# Altium schematic sheet lpGBTs.SchDoc: LpGBT
size A; DocumentNumber: 6; SheetNumber: 6; SheetTotal: 22
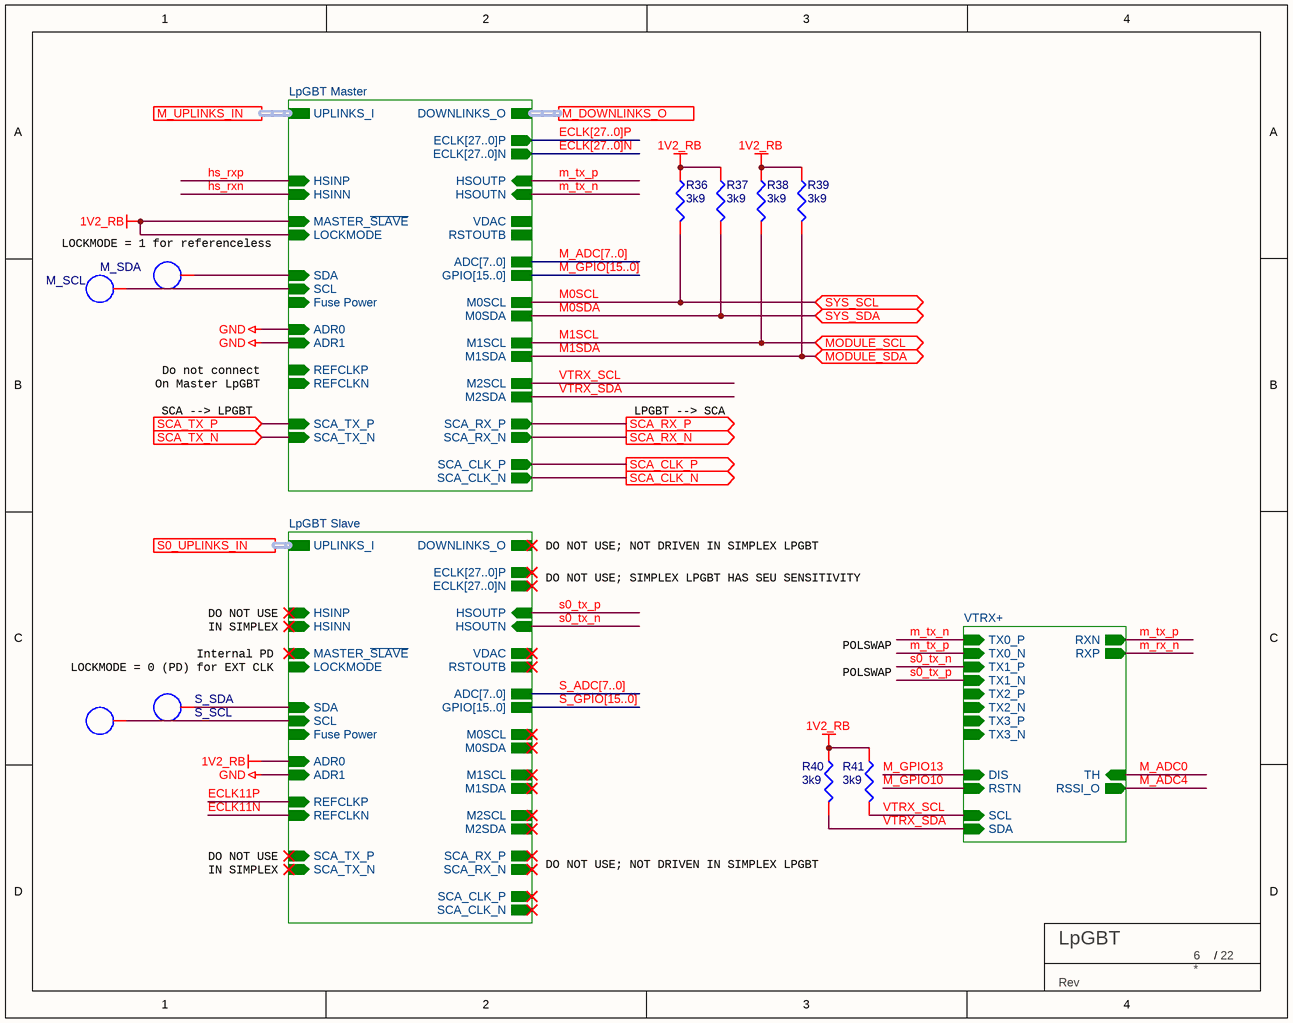
[diagram p0: lpGBTs.SchDoc]

## Parts
R36  3k9  [R_0402_IPC]
R37  3k9  [R_0402_IPC]
R38  3k9  [R_0402_IPC]
R39  3k9  [R_0402_IPC]
R40  3k9  [R_0402_IPC]
R41  3k9  [R_0402_IPC]
TBLOCK?  BU Title block  (value not drawn)  (graphical)
TP7  M_SDA  [testpoint]  (no BOM)
TP8  M_SCL  [testpoint]  (no BOM)
TP9  S_SDA  [testpoint]  (no BOM)
TP10  S_SCL  [testpoint]  (no BOM)

## Sub-sheets
LpGBT Master = lpgbt-Config.SchDoc;lpgbt-Power.SchDoc;lpgbt-Elinks.SchDoc;lpgbt-SC-HSIO.SchDoc;lpgbt-Clocks.SchDoc: DOWNLINKS_O (harness DOWNLINK), VDAC, SCA_CLK_N (out), RSTOUTB, REFCLKP (in), HSOUTN (in), SCA_TX_N (in), SCA_RX_P (out), SCL (in), ADC[7..0], MASTER_~{SLAVE} (in), SCA_RX_N (out), SCA_TX_P (in), M2SDA, HSINN (in), HSOUTP (in), Fuse Power (in), REFCLKN (in), HSINP (in), M2SCL, GPIO[15..0], ADR0 (in), UPLINKS_I (harness UPLINK), ADR1 (in), SDA (in), SCA_CLK_P (out), ECLK[27..0]N (out), ECLK[27..0]P (out), M0SDA, M0SCL, M1SCL, M1SDA, LOCKMODE (in)
LpGBT Slave = lpgbt-Config.SchDoc;lpgbt-Power.SchDoc;lpgbt-Elinks.SchDoc;lpgbt-SC-HSIO.SchDoc;lpgbt-Clocks.SchDoc: DOWNLINKS_O (harness DOWNLINK), VDAC, SCA_CLK_N (out), RSTOUTB, REFCLKP (in), HSOUTN (in), SCA_TX_N (in), SCA_RX_P (out), SCL (in), ADC[7..0], MASTER_~{SLAVE} (in), M0SDA, M0SCL, SCA_RX_N (out), M1SCL, SCA_TX_P (in), M2SDA, HSINN (in), HSOUTP (in), M1SDA, Fuse Power (in), REFCLKN (in), HSINP (in), M2SCL, GPIO[15..0], ADR0 (in), UPLINKS_I (harness UPLINK), ADR1 (in), SDA (in), SCA_CLK_P (out), ECLK[27..0]N (out), ECLK[27..0]P (out), LOCKMODE (in)
VTRX+ = VTRX.SchDoc: TX0_N (in), TX1_P (in), TX1_N (in), TX2_P (in), TX2_N (in), TX3_P (in), TX0_P (in), RXN (out), TX3_N (in), DIS (in), RXP (out), RSTN (in), TH (in), RSSI_O (out), SCL (in), SDA (in)

## Ports
M_DOWNLINKS_O (harness UPLINK), M_UPLINKS_IN (harness UPLINK), MODULE_SCL (bidir), MODULE_SDA (bidir), S0_UPLINKS_IN (harness UPLINK), SCA_CLK_N (out), SCA_CLK_P (out), SCA_RX_N (out), SCA_RX_P (out), SCA_TX_N (in), SCA_TX_P (in), SYS_SCL (bidir), SYS_SDA (bidir)

## Nets
1V2_RB: R36.1 R37.1 R38.1 R39.1 R40.1 R41.1 ; sheet LpGBT Master/MASTER_~{SLAVE}, sheet LpGBT Master/LOCKMODE, sheet LpGBT Slave/ADR0
GND: sheet LpGBT Master/ADR0, sheet LpGBT Master/ADR1, sheet LpGBT Slave/ADR1
ECLK11N: sheet LpGBT Slave/REFCLKN
ECLK11P: sheet LpGBT Slave/REFCLKP
hs_rxn: sheet LpGBT Master/HSINN
hs_rxp: sheet LpGBT Master/HSINP
M0SCL: R36.2 ; port SYS_SCL, sheet LpGBT Master/M0SCL
M0SDA: R37.2 ; port SYS_SDA, sheet LpGBT Master/M0SDA
M1SCL: R38.2 ; port MODULE_SCL, sheet LpGBT Master/M1SCL
M1SDA: R39.2 ; port MODULE_SDA, sheet LpGBT Master/M1SDA
M_ADC0: sheet VTRX+/TH
M_ADC4: sheet VTRX+/RSSI_O
M_GPIO10: sheet VTRX+/RSTN
M_GPIO13: sheet VTRX+/DIS
m_rx_n: sheet VTRX+/RXP
m_tx_n: sheet LpGBT Master/HSOUTN, sheet VTRX+/TX0_P
m_tx_p: sheet LpGBT Master/HSOUTP, sheet VTRX+/TX0_N, sheet VTRX+/RXN
s0_tx_n: sheet LpGBT Slave/HSOUTN, sheet VTRX+/TX1_P
s0_tx_p: sheet LpGBT Slave/HSOUTP, sheet VTRX+/TX1_N
SCA_CLK_N: port SCA_CLK_N, sheet LpGBT Master/SCA_CLK_N
SCA_CLK_P: port SCA_CLK_P, sheet LpGBT Master/SCA_CLK_P
SCA_RX_N: port SCA_RX_N, sheet LpGBT Master/SCA_RX_N
SCA_RX_P: port SCA_RX_P, sheet LpGBT Master/SCA_RX_P
SCA_TX_N: port SCA_TX_N, sheet LpGBT Master/SCA_TX_N
SCA_TX_P: port SCA_TX_P, sheet LpGBT Master/SCA_TX_P
VTRX_SCL: R41.2 ; sheet LpGBT Master/M2SCL, sheet VTRX+/SCL
VTRX_SDA: R40.2 ; sheet LpGBT Master/M2SDA, sheet VTRX+/SDA
NetTP7_1: TP7.1(TP) ; sheet LpGBT Master/SDA
NetTP8_1: TP8.1(TP) ; sheet LpGBT Master/SCL
NetTP9_1: TP9.1(TP) ; sheet LpGBT Slave/SDA
NetTP10_1: TP10.1(TP) ; sheet LpGBT Slave/SCL

## Buses and harness runs
bus ECLK[27..0]N = sheet LpGBT Master/ECLK[27..0]N
bus ECLK[27..0]P = sheet LpGBT Master/ECLK[27..0]P
bus M_ADC[7..0] = sheet LpGBT Master/ADC[7..0]
bus M_GPIO[15..0] = sheet LpGBT Master/GPIO[15..0]
bus S_ADC[7..0] = sheet LpGBT Slave/ADC[7..0]
bus S_GPIO[15..0] = sheet LpGBT Slave/GPIO[15..0]
harness port M_DOWNLINKS_O = sheet LpGBT Master/DOWNLINKS_O
harness port M_UPLINKS_IN = sheet LpGBT Master/UPLINKS_I
harness port S0_UPLINKS_IN = sheet LpGBT Slave/UPLINKS_I

## Notes on the sheet
- LOCKMODE = 1 for referenceless
- Do not connect
- SCA --> LPGBT
- On Master LpGBT
- LPGBT --> SCA
- DO NOT USE; NOT DRIVEN IN SIMPLEX LPGBT
- DO NOT USE
- IN SIMPLEX
- DO NOT USE; SIMPLEX LPGBT HAS SEU SENSITIVITY
- Internal PD
- LOCKMODE = 0 (PD) for EXT CLK
- POLSWAP
- (in symbol TITLE_BLOCK_BU) /; Rev

## Library data of the parts
R36-R41 = R-E3-3K9-0402-5%: RES SMD 3.9K OHM 5% 1/16W 0402
TBLOCK? = TITLE_BLOCK_BU
TP7-TP10 = TP: TEST POINT 40MIL DIA.